# EAGLE schematic Galka (EAGLE 7.0.0)
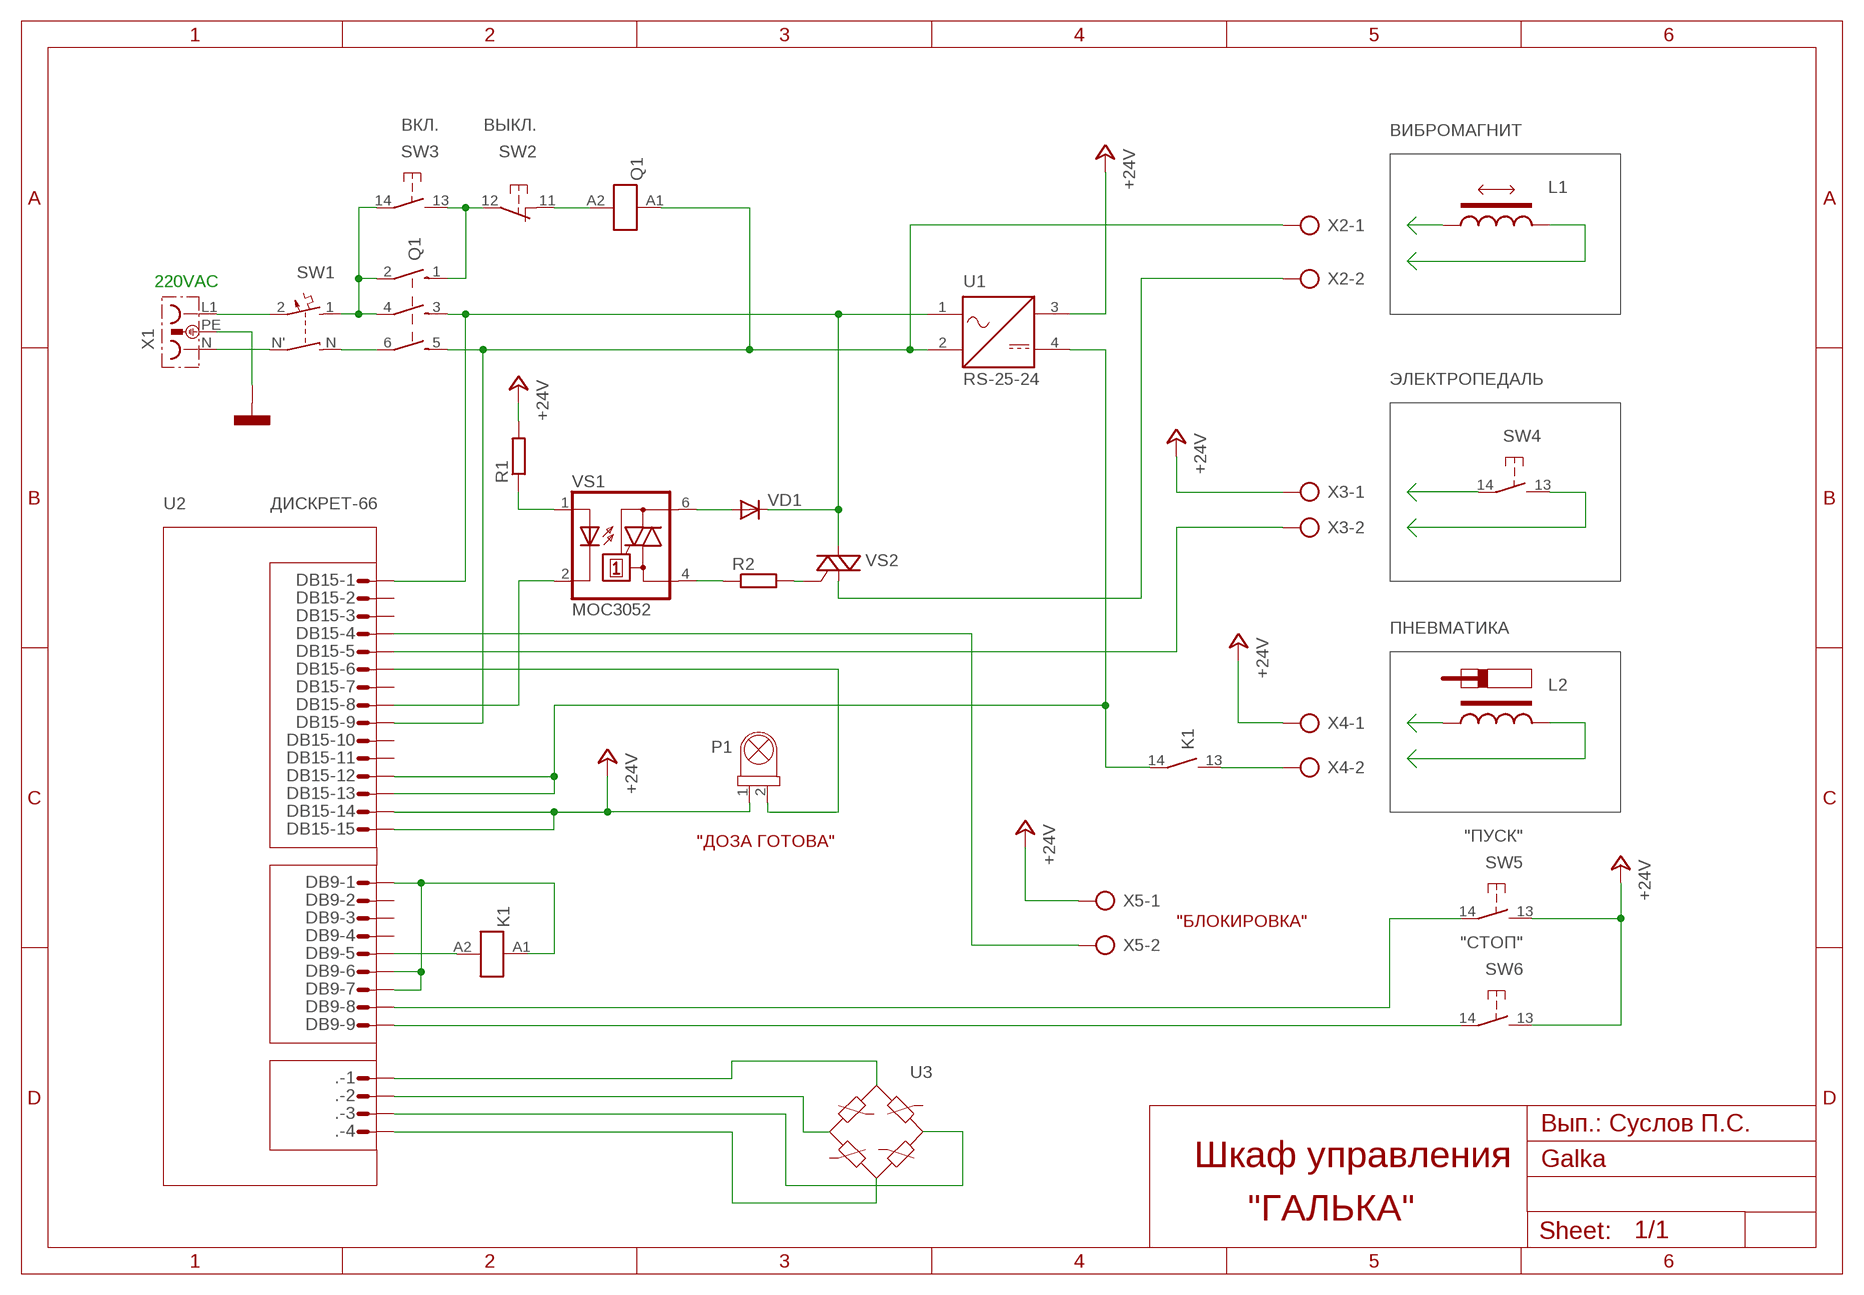
[diagram p0: schematic, sheet 1]

## Parts
.  L04P  [L04P]
DB9  L09P  [L09P]
DB15  L15P  [L15P]
K1  HILFSSCHUETZ_13-14  [HILFSSCHUETZ_13-14]
L1  L-US0204/5  [0204/5]
L2  L-US0204/5  [0204/5]
P1  BLINK/BLITZLEUCHTE  [LAMPE]
Q1  HAUPTSCHUETZ_3-POL  [HAUPTSCHUETZ_3-POL]
R1  R-EU_0204/2V  [0204V]
R2  R-EU_0204/2V  [0204V]
SW1  LEITUNGSSCHUTZSCHALTER_2-POL  [LEITUNGSSCHUTZSCHALTER_2-POL]
SW2  ВЫКЛ.  OEFFNER_TASTSCHALTER  [OEFFNER_TASTSCHALTER]
SW3  ВКЛ.  SCHLIESSER_TASTSCHALTER  [SCHLIESSER_TASTSCHALTER]
SW4  SCHLIESSER_TASTSCHALTER  [SCHLIESSER_TASTSCHALTER]
SW5  "ПУСК"  SCHLIESSER_TASTSCHALTER  [SCHLIESSER_TASTSCHALTER]
SW6  "СТОП"  SCHLIESSER_TASTSCHALTER  [SCHLIESSER_TASTSCHALTER]
U1  RS-25-24  NETZTEIL_GLEICHSPANNUNG  [NETZTEIL_GLEICHSPANNUNG]
VD1  1N4148DO35-7  [DO35-7]
VS1  MOC3052  MOC3042T  [DIL06B]
VS2  TRIAC  [TRIAC]
X1  STECKDOSE  [STECKDOSE]
X2  AK500/2  [AK500/2]
X3  AK500/2  [AK500/2]
X4  AK500/2  [AK500/2]
X5  AK500/2  [AK500/2]
X6  MASSE_ALLGEMEIN  [MASSE_ALLGEMEIN]

## Nets
+24V: DB15.14 DB15.15 P1.1(X1) R1.2 SW5.13 SW6.13 U1.3 X3.1 X4.1 X5.1
N$1: DB15.5 X3.2
N$2: SW1.N'(N) X1.N
N$3: R2.1 VS1.4(A1)
N$4: DB15.9 Q1.5 Q1.A1 U1.2 X2.1
N$5: Q1.2 Q1.4 SW1.1 SW3.14
N$6: Q1.6 SW1.N
N$7: DB15.12 DB15.13 K1.14 U1.4
N$8: R2.2 VS2.G
N$9: VD1.A VS1.6(A2)
N$10: VS2.A2 X2.2
N$11: R1.1 VS1.1(A)
N$12: DB15.8 VS1.2(C)
N$13: Q1.1 SW2.12 SW3.13
N$14: X1.PE X6.1(0V)
N$15: DB9.9 SW6.14
N$16: ..1
N$17: ..2
N$18: ..3
N$19: ..4
N$20: L1.1
N$21: L1.2
N$22: SW4.14
N$23: SW4.13
N$24: Q1.A2 SW2.11
N$25: DB9.8 SW5.14
N$26: L2.1
N$27: L2.2
N$28: DB9.1 DB9.6 DB9.7 K1.A1
N$29: DB9.5 K1.A2
N$30: K1.13 X4.2
N$31: DB15.6 P1.2(X2)
N$32: DB15.4 X5.2
SW1: DB15.1 Q1.3 SW1.2 U1.1 VD1.C VS2.A1 X1.L1
Unconnected: DB9.2 DB9.3 DB9.4 DB15.2 DB15.3 DB15.7 DB15.10 DB15.11

## Notes on the sheet
- ВИБРОМАГНИТ
- 220VAC
- ЭЛЕКТРОПЕДАЛЬ
- U2 | ДИСКРЕТ-66
- ПНЕВМАТИКА
- "ДОЗА ГОТОВА"
- "БЛОКИРОВКА"
- U3
- Вып.: Суслов П.С.
- Шкаф управления
- "ГАЛЬКА"

## Library data of the parts
. = con-amp-mt:L04P: AMP MT CONNECTOR; OC_FARNELL: unknown; OC_NEWARK: unknown
DB9 = con-amp-mt:L09P: AMP MT CONNECTOR; OC_FARNELL: unknown; OC_NEWARK: unknown
DB15 = con-amp-mt:L15P: AMP MT CONNECTOR; OC_FARNELL: unknown; OC_NEWARK: unknown
K1 = e-schuetze-relais:HILFSSCHUETZ_13-14: Hilfsschütz mit 1 Schließer
L1 L2 = rcl:L-US: INDUCTOR, American symbol
P1 = e-lampen-signalisation:BLINK/BLITZLEUCHTE: Blink-, Blitzleuchte
Q1 = e-schuetze-relais:HAUPTSCHUETZ_3-POL: Hauptschütz mit 3 Schließern
R1 R2 = rcl:R-EU_: RESISTOR, European symbol
SW1 = e-sicherungen:LEITUNGSSCHUTZSCHALTER_2-POL: Leitungsschutzschalter, 2-pol.
SW2 = e-schalter:OEFFNER_TASTSCHALTER: Tastschalter, Öffner
SW3-SW6 = e-schalter:SCHLIESSER_TASTSCHALTER: Tastschalter, Schließer
U1 = e-stromversorgungselemente:NETZTEIL_GLEICHSPANNUNG: Netzteil, Gleichspannung
VD1 = diode:1N4148: DIODE high speed (Philips)
VS1 = optocoupler:MOC30*: 6-Pin DIP Zero-Cross Optoisolators Triac Driver Output (250/400 Volt Peak) Source: Data sheet <http://www.fairchildsemi.com/ds/MO/MOC3031M.pdf> The old path of data sheet not more available 2013-05-06.; OC_FARNELL: unknown; OC_NEWARK: unknown
VS2 = e-halbleiter:TRIAC: Triac
X1 = e-steckverbinder:STECKDOSE: Steckdose mit Schutzleiter
X2-X5 = con-ptr500:AK500/2: CONNECTOR; OC_FARNELL: unknown; OC_NEWARK: unknown
X6 = e-klemmen:MASSE_ALLGEMEIN: Masse allgemein